# EAGLE design IOIO-NXT-V1 (EAGLE 6.6.0)
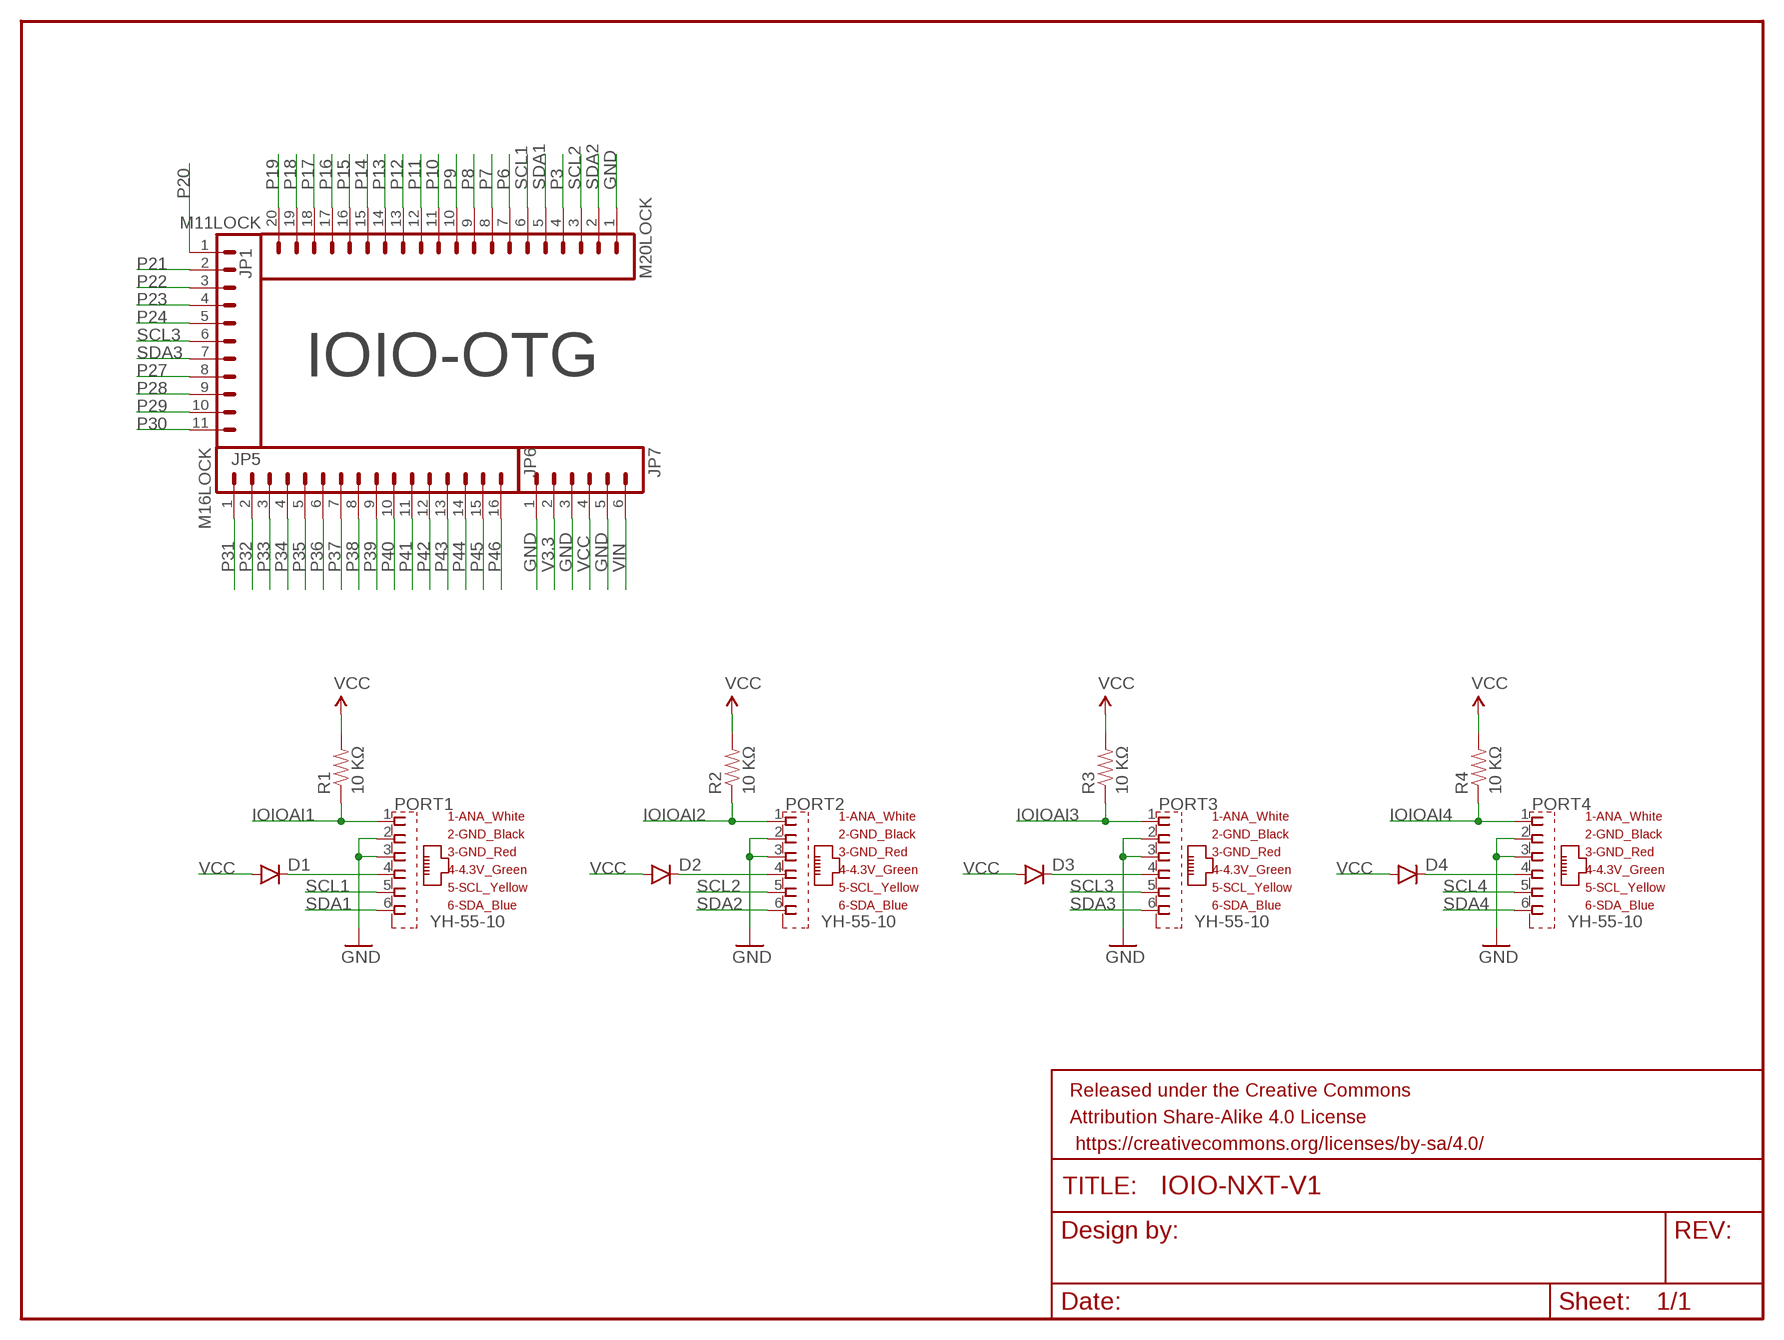
[diagram p0: schematic, sheet 1]

## Parts
D1  DIODE  [DIODE-1N4001-KIT]
D2  DIODE  [DIODE-1N4001-KIT]
D3  DIODE  [DIODE-1N4001-KIT]
D4  DIODE  [DIODE-1N4001-KIT]
FRAME1  FRAME-LETTER  [CREATIVE_COMMONS]
JP1  M20LOCK  [1X20_LOCK]
JP5  M11LOCK  [1X11_LOCK]
JP6  M16LOCK  [1X16_LOCK]
JP7  M06LOCK  [1X06_LOCK]
PORT1  YH-55-10  [YH-55-10]
PORT2  YH-55-10  [YH-55-10]
PORT3  YH-55-10  [YH-55-10]
PORT4  YH-55-10  [YH-55-10]
R1  10 KΩ  RESISTORPTH-1/4W  [AXIAL-0.4]
R2  10 KΩ  RESISTORPTH-1/4W  [AXIAL-0.4]
R3  10 KΩ  RESISTORPTH-1/4W  [AXIAL-0.4]
R4  10 KΩ  RESISTORPTH-1/4W  [AXIAL-0.4]

## Nets
GND: JP1.1 JP7.1 JP7.3 JP7.5 PORT1.2(2_GND_BLACK) PORT1.3(3_GND_RED) PORT2.2(2_GND_BLACK) PORT2.3(3_GND_RED) PORT3.2(2_GND_BLACK) PORT3.3(3_GND_RED) PORT4.2(2_GND_BLACK) PORT4.3(3_GND_RED)
IOIOAI1: PORT1.1(1_ANA_WHITE) R1.P$1
IOIOAI2: PORT2.1(1_ANA_WHITE) R2.P$1
IOIOAI3: PORT3.1(1_ANA_WHITE) R3.P$1
IOIOAI4: PORT4.1(1_ANA_WHITE) R4.P$1
N$1: D1.C PORT1.4(4_4.3V_GREEN)
N$2: D4.C PORT4.4(4_4.3V_GREEN)
N$3: D2.C PORT2.4(4_4.3V_GREEN)
N$4: D3.C PORT3.4(4_4.3V_GREEN)
P3: JP1.4
P6: JP1.7
P7: JP1.8
P8: JP1.9
P9: JP1.10
P10: JP1.11
P11: JP1.12
P12: JP1.13
P13: JP1.14
P14: JP1.15
P15: JP1.16
P16: JP1.17
P17: JP1.18
P18: JP1.19
P19: JP1.20
P20: JP5.1
P21: JP5.2
P22: JP5.3
P23: JP5.4
P24: JP5.5
P27: JP5.8
P28: JP5.9
P29: JP5.10
P30: JP5.11
P31: JP6.1
P32: JP6.2
P33: JP6.3
P34: JP6.4
P35: JP6.5
P36: JP6.6
P37: JP6.7
P38: JP6.8
P39: JP6.9
P40: JP6.10
P41: JP6.11
P42: JP6.12
P43: JP6.13
P44: JP6.14
P45: JP6.15
P46: JP6.16
SCL1: JP1.6 PORT1.5(5_SCL_YELLOW)
SCL2: JP1.3 PORT2.5(5_SCL_YELLOW)
SCL3: JP5.6 PORT3.5(5_SCL_YELLOW)
SCL4: PORT4.5(5_SCL_YELLOW)
SDA1: JP1.5 PORT1.6(6_SDA_BLUE)
SDA2: JP1.2 PORT2.6(6_SDA_BLUE)
SDA3: JP5.7 PORT3.6(6_SDA_BLUE)
SDA4: PORT4.6(6_SDA_BLUE)
V3.3: JP7.2
VCC: D1.A D2.A D3.A D4.A JP7.4 R1.P$2 R2.P$2 R3.P$2 R4.P$2
VIN: JP7.6

## Notes on the sheet
- IOIO-OTG

## Library data of the parts
D1-D4 = SparkFun-DiscreteSemi:DIODE: Diode These are standard reverse protection diodes and small signal diodes. SMA package can handle up to about 1A. SOD-323 can handle about 200mA. What the SOD-323 package when ordering, there are some mfgs out there that are 5-pin packages.
FRAME1 = SparkFun-Aesthetics:FRAME-LETTER: Schematic Frame Standard 8.5x11 US Letter frame
JP1 = SparkFun-Connectors:M20: 1x20 .1" header This is just like the LOCK variant in that the holes are staggared by 5 mil, but except for the last two holes. They are not altered from the "standard" footprint layout. This is used for a special purpose on the layout of our Graphic LCD Backpack. Make sure you want to use this device before selecting it for you project!
JP5 = SparkFun-Connectors:M11: Header 11 Standard 11-pin 0.1" header. Use with straight break away headers (SKU : PRT-00116), right angle break away headers (PRT-00553), swiss pins (PRT-00743), machine pins (PRT-00117), and female headers (PRT-00115).
JP6 = SparkFun-Connectors:M16: 1x16 .1" header
JP7 = SparkFun-Connectors:M06: Header 6 Standard 6-pin 0.1" header. Use with straight break away headers (SKU : PRT-00116), right angle break away headers (PRT-00553), swiss pins (PRT-00743), machine pins (PRT-00117), and female headers (PRT-00115). Molex polarized connector foot print use with SKU : PRT-08094 with associated crimp pins and housings. NOTES ON THE VARIANTS LOCK and LOCK_LONGPADS... This footprint was designed to help hold the alignment of a through-hole component (i.e. 6-pin header) while soldering it into place. You may notice that each hole has been shifted either up or down by 0.005 of an inch from it's more standard position (which is a perfectly straight line). This slight alteration caused the pins (the squares in the middle) to touch the edges of the holes. Because they are alternating, it causes a "brace" to hold the component in place. 0.005 has proven to be the perfect amount of "off-center" position when using our standard breakaway headers. Although looks a little odd when you look at the bare footprint, once you have a header in there, the alteration is very hard to notice. Also,if you push a header all the way into place, it is covered up entirely on the bottom side. This idea of altering the position of holes to aid alignment will be further integrated into the Sparkfun Library for other footprints. It can help hold any component with 3 or more connection pins.
PORT1-PORT4 = Dexter_Industries_Eagle_Library_Female_Sockets:YH-55-10: RJ11 6 connects Source:Dexter Industries LEGO MINDSTORMS NXT Female Adapter; OC_FARNELL: unknown; OC_NEWARK: unknown
R1-R4 = SparkFun-Resistors:RESISTOR: Resistor Basic schematic elements and footprints for 0603, 1206, and PTH resistors.

## Board
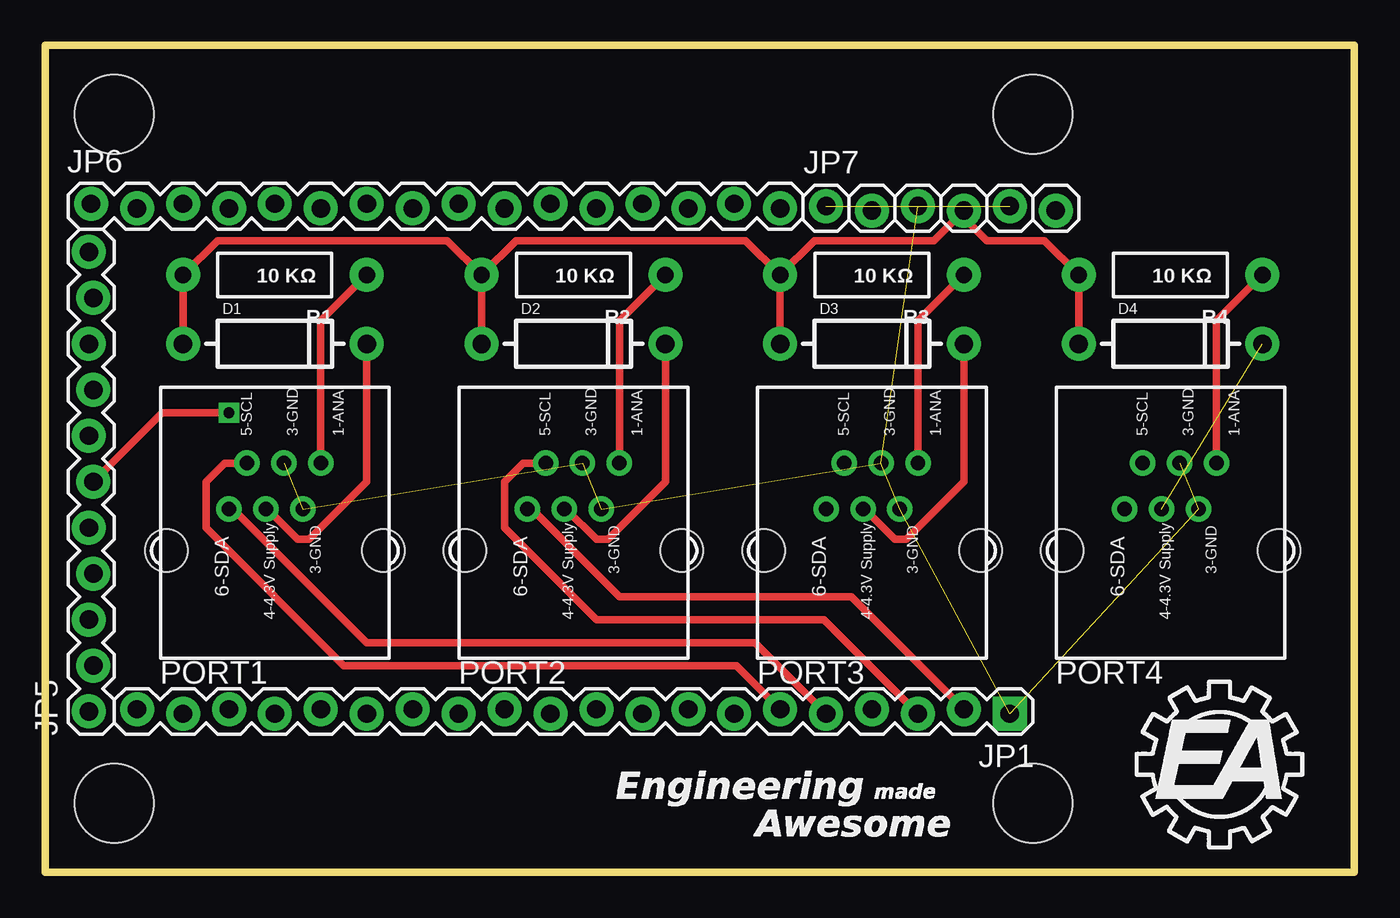
[diagram p1: board, top side]
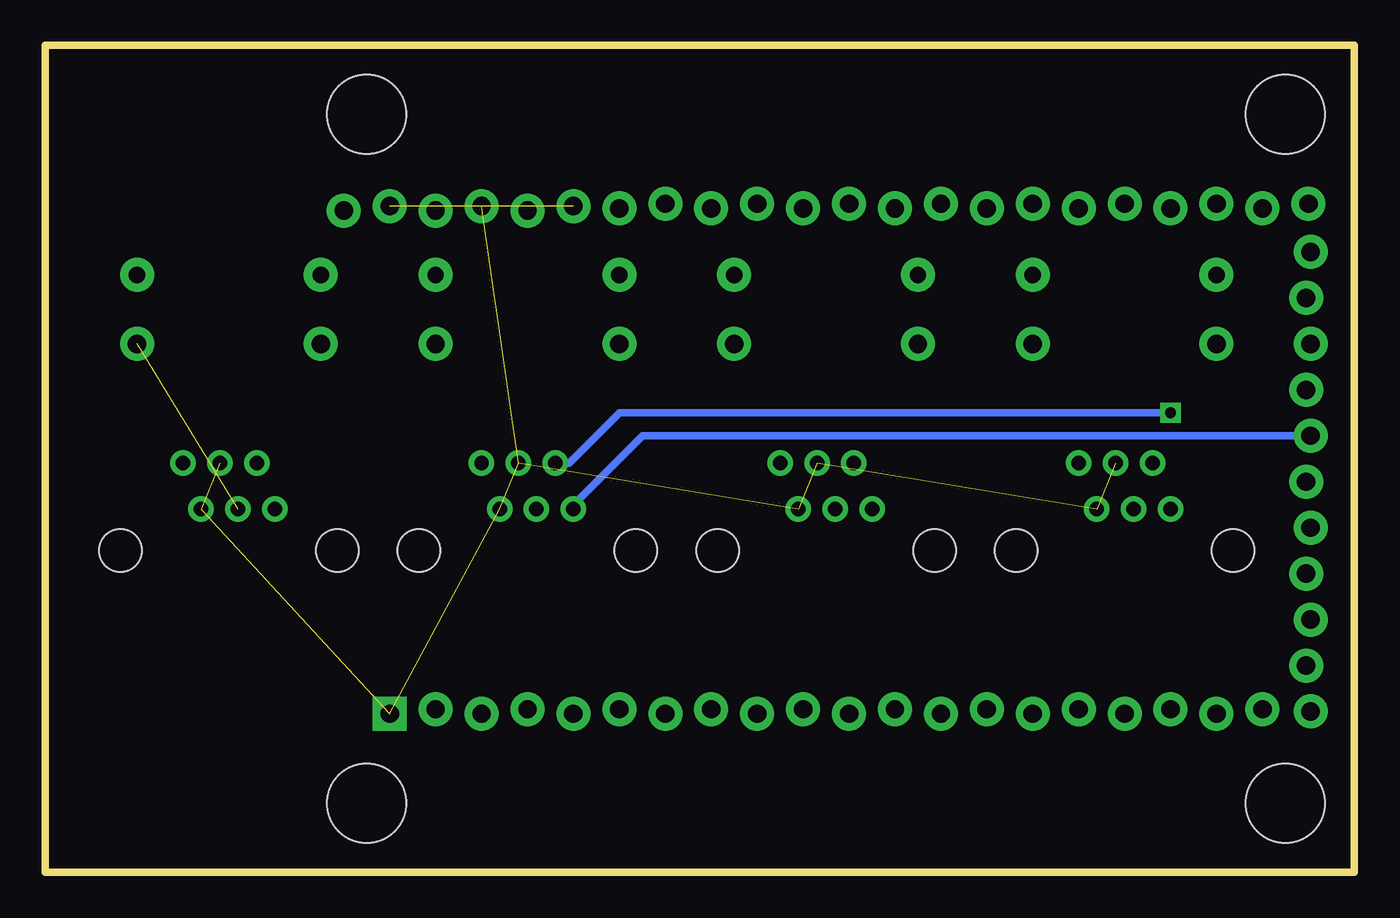
[diagram p2: board, bottom side, seen from below]

Size 72.39 x 45.72 mm. Coordinates in mm from the lower left corner, seen from the top.
Outline: 0,0 0,45.72 72.39,45.72 72.39,0 0,0
Copper layers (1*16): Top 0.035mm / dielectric 1.5mm / Bottom 0.035mm
Design rules "SparkFun": minimum track width 8mil, minimum drill 20mil, track to track 8mil, track to pad 8mil, pad to pad 8mil, via to via 8mil, smd to smd 8mil, copper to edge 8mil, drill to drill 8mil, minimum pad ring 12mil, minimum via ring 10mil, stop-mask expansion 4mil, vias tented up to drill 20mil, thermal gap 10mil
Holes 4.37 mm at 3.81,3.81 54.61,3.81 54.61,41.91 3.81,41.91

### Footprints (pad centres in the part's own frame; a part is rotated, then mirrored left to right if it is on the bottom)
DIODE-1N4001-KIT = drill 1.016 pad 1.88: A -5.08,0; C 5.08,0
1X20_LOCK = drill 1.016 pad 1.88 square: 1 0,0.127 | drill 1.016 pad 1.88: 2 2.54,-0.127; 3 5.08,0.127; 4 7.62,-0.127; 5 10.16,0.127; 6 12.7,-0.127; 7 15.24,0.127; 8 17.78,-0.127; 9 20.32,0.127; 10 22.86,-0.127; 11 25.4,0.127; 12 27.94,-0.127; 13 30.48,0.127; 14 33.02,-0.127; 15 35.56,0.127; 16 38.1,-0.127; 17 40.64,0.127; 18 43.18,-0.127; 19 45.72,0.127; 20 48.26,-0.127
1X11_LOCK = drill 1.016 pad 1.88: 1 0,0.127; 2 2.54,-0.127; 3 5.08,0.127; 4 7.62,-0.127; 5 10.16,0.127; 6 12.7,-0.127; 7 15.24,0.127; 8 17.78,-0.127; 9 20.32,0.127; 10 22.86,-0.127; 11 25.4,0.127
1X16_LOCK = drill 1.016 pad 1.88: 1 0,0.127; 2 2.54,-0.127; 3 5.08,0.127; 4 7.62,-0.127; 5 10.16,0.127; 6 12.7,-0.127; 7 15.24,0.127; 8 17.78,-0.127; 9 20.32,0.127; 10 22.86,-0.127; 11 25.4,0.127; 12 27.94,-0.127; 13 30.48,0.127; 14 33.02,-0.127; 15 35.56,0.127; 16 38.1,-0.127
1X06_LOCK = drill 1.016 pad 1.88: 1 0,0; 2 2.54,-0.254; 3 5.08,0; 4 7.62,-0.254; 5 10.16,0; 6 12.7,-0.254
YH-55-10 = drill 0.8 pad 1.3: 1 2.54,4.84; 2 1.54,2.3; 3 0.5,4.84; 4 -0.5,2.3; 5 -1.54,4.84; 6 -2.54,2.3 | hole 2.36: -6,0; 6,0
AXIAL-0.4 = drill 0.9 pad 1.88: P$1 -5.08,0; P$2 5.08,0

### Placement (x,y rotation side)
D1  12.7,29.21 0 top
D2  29.21,29.21 0 top
D3  45.72,29.21 0 top
D4  62.23,29.21 0 top
FRAME1  24.13,-10.16 0 top  (outside the outline)
JP1  53.34,8.89 180 top
JP5  2.54,8.89 90 top
JP6  2.54,36.83 0 top
JP7  43.18,36.83 0 top
PORT1  12.7,17.78 0 top
PORT2  29.21,17.78 0 top
PORT3  45.72,17.78 0 top
PORT4  62.23,17.78 0 top
R1  12.7,33.02 180 top
R2  29.21,33.02 180 top
R3  45.72,33.02 180 top
R4  62.23,33.02 180 top

### Tracks (layer width: path | path; a pad name or v marks a point on that pad's centre or on a via)
GND  (11 unrouted)
IOIOAI1
  Top 0.406: R1.P$1 15.24,30.48 PORT1.1
IOIOAI2
  Top 0.406: R2.P$1 31.75,30.48 PORT2.1
IOIOAI3
  Top 0.406: R3.P$1 48.26,30.48 PORT3.1
IOIOAI4
  Top 0.406: R4.P$1 64.77,30.48 PORT4.1
N$1
  Top 0.406: PORT1.4 12.31,20.08 13.97,18.41 14.61,18.41 17.78,21.59 D1.C
N$2  (1 unrouted)
N$3
  Top 0.406: PORT2.4 28.82,20.08 30.48,18.41 31.12,18.41 34.29,21.59 D2.C
N$4
  Top 0.406: PORT3.4 45.33,20.08 46.99,18.41 47.63,18.41 50.8,21.59 D3.C
SCL1
  Top 0.406: PORT1.5 9.92,22.62 8.89,21.59 8.89,19.05 16.51,11.43 38.23,11.43 JP1.6
SCL2
  Top 0.406: PORT2.5 26.43,22.62 25.4,21.59 25.4,19.05 30.48,13.97 43.05,13.97 JP1.3
SCL3  (via drill 0.6)
  Top 0.406: v10.16,25.4 6.48,25.4 JP5.6
  Bottom 0.406: PORT3.5 43.42,22.62 40.64,25.4 v10.16,25.4
SDA1
  Top 0.406: PORT1.6 10.4,20.08 17.78,12.7 39.24,12.7 JP1.5
SDA2
  Top 0.406: JP1.2 44.58,15.24 31.75,15.24 26.91,20.08 PORT2.6
SDA3
  Bottom 0.406: PORT3.6 43.18,20.32 39.37,24.13 JP5.7
VCC
  Top 0.406: D1.A R1.P$2 9.53,34.93 22.23,34.93 R2.P$2 | R3.P$2 D3.A | D4.A R4.P$2 55.25,34.93 52.07,34.93 50.8,36.2 JP7.4 49.15,34.93 42.55,34.93 R3.P$2 | D2.A R2.P$2 | R2.P$2 26.04,34.93 38.74,34.93 R3.P$2